# Altium schematic sheet MAX5875_2.SchDoc
size A; SheetNumber: 15; SheetTotal: 24
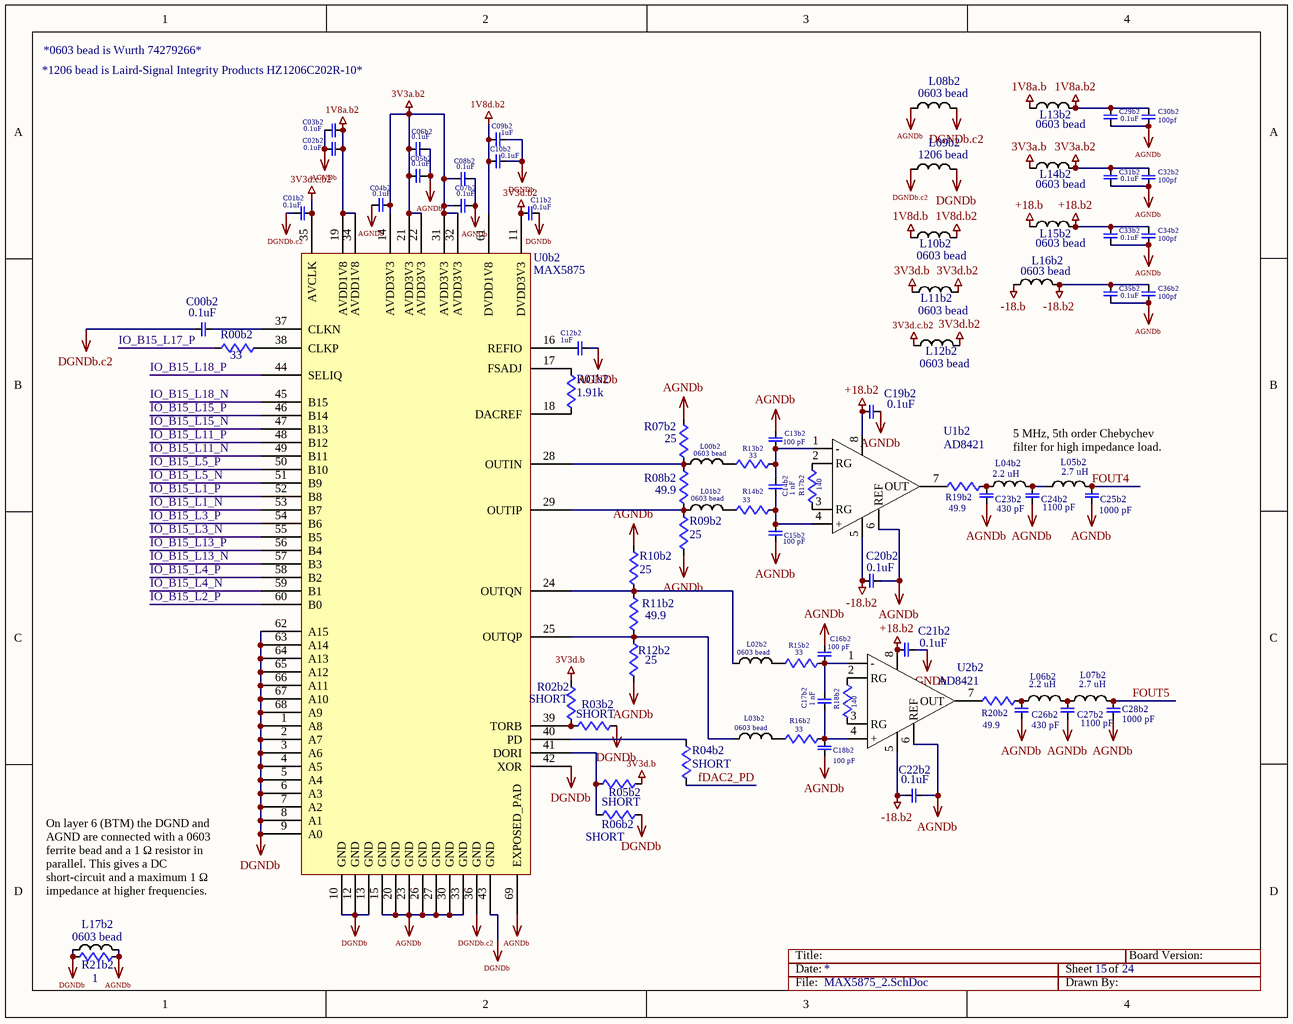
[diagram p0: MAX5875_2.SchDoc]

## Parts
C00b2  0.1uF  [0402]
C01b2  0.1uF  [0402]
C02b2  0.1uF  [0402]
C03b2  0.1uF  [0402]
C04b2  0.1uF  [0402]
C05b2  0.1uF  [0402]
C06b2  0.1uF  [0402]
C07b2  0.1uF  [0402]
C08b2  0.1uF  [0402]
C09b2  1uF  [0603]
C10b2  0.1uF  [0402]
C11b2  0.1uF  [0402]
C12b2  1uF  [0402]
C13b2  100 pF  [0603]
C14b2  1 nF  [0603]
C15b2  100 pF  [0603]
C16b2  100 pF  [0603]
C17b2  1 nF  [0603]
C18b2  100 pF  [0603]
C19b2  0.1uF  [0603]
C20b2  0.1uF  [0603]
C21b2  0.1uF  [0603]
C22b2  0.1uF  [0603]
C23b2  430 pF  [0603]
C24b2  1100 pF  [0603]
C25b2  1000 pF  [0603]
C26b2  430 pF  [0603]
C27b2  1100 pF  [0603]
C28b2  1000 pF  [0603]
C29b2  0.1uF  [0603]
C30b2  100pf  [0603]
C31b2  0.1uF  [0603]
C32b2  100pf  [0603]
C33b2  0.1uF  [0603]
C34b2  100pf  [0603]
C35b2  0.1uF  [0603]
C36b2  100pf  [0603]
L00b2  0603 bead  [0603]
L01b2  0603 bead  [0603]
L02b2  0603 bead  [0603]
L03b2  0603 bead  [0603]
L04b2  2.2 uH  [0603]
L05b2  2.7 uH  [0603]
L06b2  2.2 uH  [0603]
L07b2  2.7 uH  [0603]
L08b2  0603 bead  [0603]
L09b2  1206 bead  [1206]
L10b2  0603 bead  [0603]
L11b2  0603 bead  [0603]
L12b2  0603 bead  [0603]
L13b2  0603 bead  [0603]
L14b2  0603 bead  [0603]
L15b2  0603 bead  [0603]
L16b2  0603 bead  [0603]
L17b2  0603 bead  [0603]
R00b2  33  [0402]
R01b2  1.91k  [0603]
R02b2  SHORT  [0603]
R03b2  SHORT  [0603]
R04b2  SHORT  [0603]
R05b2  SHORT  [0603]
R06b2  SHORT  [0603]
R07b2  25  [0603]
R08b2  49.9  [0603]
R09b2  25  [0603]
R10b2  25  [0603]
R11b2  49.9  [0603]
R12b2  25  [0603]
R13b2  33  [0603]
R14b2  33  [0603]
R15b2  33  [0603]
R16b2  33  [0603]
R17b2  140  [0402]
R18b2  140  [0402]
R19b2  49.9  [0603]
R20b2  49.9  [0603]
R21b2  1  [0603]
U0b2  MAX5875  [68LQFN]
U1b2  AD8421  [8SOIC]
U2b2  AD8421  [8SOIC]

## Nets
1V8a.b: L13b2.1
1V8a.b2: C02b2.1 C03b2.2 C29b2.1 C30b2.1 L13b2.2 U0b2.19(AVDD1V8) U0b2.34(AVDD1V8)
1V8d.b: L10b2.1
1V8d.b2: C09b2.2 C10b2.2 L10b2.2 U0b2.61(DVDD1V8)
3V3a.b: L14b2.1
3V3a.b2: C04b2.1 C05b2.2 C06b2.1 C07b2.2 C08b2.1 C31b2.1 C32b2.1 L14b2.2 U0b2.14(AVDD3V3) U0b2.21(AVDD3V3) U0b2.22(AVDD3V3) U0b2.31(AVDD3V3) U0b2.32(AVDD3V3)
3V3d.b: L11b2.1 R02b2.2 R05b2.2
3V3d.b2: C11b2.2 L11b2.2 L12b2.2 U0b2.11(DVDD3V3)
3V3d.c.b2: C01b2.1 L12b2.1 U0b2.35(AVCLK)
+18.b: L15b2.1
+18.b2: C19b2.2 C21b2.2 C33b2.1 C34b2.1 L15b2.2 U1b2.8(+VS) U2b2.8(+VS)
-18.b: L16b2.1
-18.b2: C20b2.2 C22b2.2 C35b2.1 C36b2.1 L16b2.2 U1b2.5(-VS) U2b2.5(-VS)
AGNDb: C02b2.2 C03b2.1 C04b2.2 C05b2.1 C06b2.2 C07b2.1 C08b2.2 C12b2.1 C13b2.1 C15b2.1 C16b2.1 C18b2.1 C19b2.1 C20b2.1 C21b2.1 C22b2.1 C23b2.2 C24b2.2 C25b2.2 C26b2.2 C27b2.2 C28b2.2 C29b2.2 C30b2.2 C31b2.2 C32b2.2 C33b2.2 C34b2.2 C35b2.2 C36b2.2 L08b2.1 L17b2.2 R07b2.2 R09b2.1 R10b2.2 R12b2.1 R21b2.1 U0b2.15(GND) U0b2.20(GND) U0b2.23(GND) U0b2.26(GND) U0b2.27(GND) U0b2.30(GND) U0b2.33(GND) U0b2.69(EXPOSED_PAD) U1b2.6(REF) U2b2.6(REF)
DGNDb: C09b2.1 C10b2.1 C11b2.1 L09b2.2 L17b2.1 R03b2.2 R06b2.2 R21b2.2 U0b2.1(A8) U0b2.2(A7) U0b2.3(A6) U0b2.4(A5) U0b2.5(A4) U0b2.6(A3) U0b2.7(A2) U0b2.8(A1) U0b2.9(A0) U0b2.10(GND) U0b2.12(GND) U0b2.13(GND) U0b2.42(XOR) U0b2.43(GND) U0b2.62(A15) U0b2.63(A14) U0b2.64(A13) U0b2.65(A12) U0b2.66(A11) U0b2.67(A10) U0b2.68(A9)
DGNDb.c2: C00b2.2 C01b2.2 L08b2.2 L09b2.1 U0b2.36(GND)
fDAC2_PD: R04b2.2
FOUT4: C25b2.1 L05b2.2
FOUT5: C28b2.1 L07b2.2
IO_B15_L1_N: U0b2.53(B7)
IO_B15_L1_P: U0b2.52(B8)
IO_B15_L2_P: U0b2.60(B0)
IO_B15_L3_N: U0b2.55(B5)
IO_B15_L3_P: U0b2.54(B6)
IO_B15_L4_N: U0b2.59(B1)
IO_B15_L4_P: U0b2.58(B2)
IO_B15_L5_N: U0b2.51(B9)
IO_B15_L5_P: U0b2.50(B10)
IO_B15_L11_N: U0b2.49(B11)
IO_B15_L11_P: U0b2.48(B12)
IO_B15_L13_N: U0b2.57(B3)
IO_B15_L13_P: U0b2.56(B4)
IO_B15_L15_N: U0b2.47(B13)
IO_B15_L15_P: U0b2.46(B14)
IO_B15_L17_P: R00b2.1
IO_B15_L18_N: U0b2.45(B15)
IO_B15_L18_P: U0b2.44(SELIQ)
NetC00b2_1: C00b2.1 U0b2.37(CLKN)
NetC12b2_2: C12b2.2 U0b2.16(REFIO)
NetC13b2_2: C13b2.2 C14b2.1 R13b2.1 U1b2.1(-)
NetC14b2_2: C14b2.2 C15b2.2 R14b2.1 U1b2.4(+)
NetC16b2_2: C16b2.2 C17b2.1 R15b2.1 U2b2.1(-)
NetC17b2_2: C17b2.2 C18b2.2 R16b2.1 U2b2.4(+)
NetC23b2_1: C23b2.1 L04b2.1 R19b2.2
NetC24b2_1: C24b2.1 L04b2.2 L05b2.1
NetC26b2_1: C26b2.1 L06b2.1 R20b2.2
NetC27b2_1: C27b2.1 L06b2.2 L07b2.1
NetL00b2_1: L00b2.1 R07b2.1 R08b2.2 U0b2.28(OUTIN)
NetL00b2_2: L00b2.2 R13b2.2
NetL01b2_1: L01b2.1 R08b2.1 R09b2.2 U0b2.29(OUTIP)
NetL01b2_2: L01b2.2 R14b2.2
NetL02b2_1: L02b2.1 R10b2.1 R11b2.2 U0b2.24(OUTQN)
NetL02b2_2: L02b2.2 R15b2.2
NetL03b2_1: L03b2.1 R11b2.1 R12b2.2 U0b2.25(OUTQP)
NetL03b2_2: L03b2.2 R16b2.2
NetR00b2_2: R00b2.2 U0b2.38(CLKP)
NetR01b2_1: R01b2.1 U0b2.18(DACREF)
NetR01b2_2: R01b2.2 U0b2.17(FSADJ)
NetR02b2_1: R02b2.1 R03b2.1 U0b2.39(TORB)
NetR04b2_1: R04b2.1 U0b2.40(PD)
NetR05b2_1: R05b2.1 R06b2.1 U0b2.41(DORI)
NetR17b2_1: R17b2.1 U1b2.3(RG)
NetR17b2_2: R17b2.2 U1b2.2(RG)
NetR18b2_1: R18b2.1 U2b2.3(RG)
NetR18b2_2: R18b2.2 U2b2.2(RG)
NetR19b2_1: R19b2.1 U1b2.7(OUT)
NetR20b2_1: R20b2.1 U2b2.7(OUT)

## Notes on the sheet
- *1206 bead is Laird-Signal Integrity Products HZ1206C202R-10*
- *0603 bead is Wurth 74279266*
- 5 MHz, 5th order Chebychev filter for high impedance load.
- On layer 6 (BTM) the DGND and AGND are connected with a 0603 ferrite bead and a 1 Ω resistor in parallel. This gives a DC short-circuit and a maximum 1 Ω impedance at higher frequencies.
- Title:
- Date:
- Sheet
- of
- Board Version:
- File:
- Drawn By:

## Library data of the parts
C00b2 C01b2 C02b2 C03b2 C04b2 C05b2 C06b2 C07b2 C08b2 C09b2 C10b2 C11b2 C12b2 C13b2 C14b2 C15b2 C16b2 C17b2 C18b2 C19b2 C20b2 C21b2 C22b2 C23b2 C24b2 C25b2 C26b2 C27b2 C28b2 C29b2 C30b2 C31b2 C32b2 C33b2 C34b2 C35b2 C36b2 = CAP
L00b2 L01b2 L02b2 L03b2 L04b2 L05b2 L06b2 L07b2 L08b2 L09b2 L10b2 L11b2 L12b2 L13b2 L14b2 L15b2 L16b2 L17b2 = INDUCTOR
R00b2 R01b2 R02b2 R03b2 R04b2 R05b2 R06b2 R07b2 R08b2 R09b2 R10b2 R11b2 R12b2 R13b2 R14b2 R15b2 R16b2 R17b2 R18b2 R19b2 R20b2 R21b2 = RES